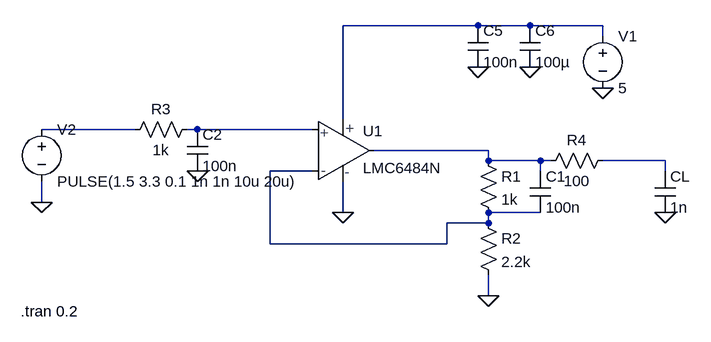
[diagram p0: schematic Levelshifter.asc]
Levelshifter.asc, the LTspice schematic file:
Version 4
SHEET 1 1276 680
WIRE 384 -32 176 -32
WIRE 464 -32 384 -32
WIRE 576 -32 464 -32
WIRE 576 -16 576 -32
WIRE 176 112 176 -32
WIRE -144 128 -288 128
WIRE -48 128 -64 128
WIRE 128 128 -48 128
WIRE 400 160 224 160
WIRE 400 176 400 160
WIRE 480 176 400 176
WIRE 496 176 480 176
WIRE 672 176 576 176
WIRE 128 192 64 192
WIRE 480 192 480 176
WIRE 672 192 672 176
WIRE -288 240 -288 208
WIRE 176 256 176 208
WIRE 480 256 400 256
WIRE 400 272 400 256
WIRE 400 272 336 272
WIRE 64 304 64 192
WIRE 336 304 336 272
WIRE 336 304 64 304
WIRE 400 384 400 352
FLAG 400 384 0
FLAG 176 256 0
FLAG 384 32 0
FLAG 464 32 0
FLAG -48 192 0
FLAG -288 240 0
FLAG 576 64 0
FLAG 672 256 0
SYMBOL res 384 160 R0
SYMATTR InstName R1
SYMATTR Value 1k
SYMBOL res 384 256 R0
SYMATTR InstName R2
SYMATTR Value 2.2k
SYMBOL res -48 112 R90
WINDOW 0 0 56 VBottom 2
WINDOW 3 32 56 VTop 2
SYMATTR InstName R3
SYMATTR Value 1k
SYMBOL res 592 160 R90
WINDOW 0 0 56 VBottom 2
WINDOW 3 32 56 VTop 2
SYMATTR InstName R4
SYMATTR Value 100
SYMBOL cap -64 128 R0
SYMATTR InstName C2
SYMATTR Value 100n
SYMBOL cap 368 -32 R0
SYMATTR InstName C5
SYMATTR Value 100n
SYMBOL cap 448 -32 R0
SYMATTR InstName C6
SYMATTR Value 100µ
SYMBOL cap 464 192 R0
SYMATTR InstName C1
SYMATTR Value 100n
SYMBOL voltage 576 -32 R0
WINDOW 123 0 0 Left 0
WINDOW 39 0 0 Left 0
SYMATTR InstName V1
SYMATTR Value 5
SYMBOL voltage -288 112 R0
WINDOW 123 0 0 Left 0
WINDOW 39 0 0 Left 0
SYMATTR InstName V2
SYMATTR Value PULSE(1.5 3.3 0.1 1n 1n 10u 20u)
SYMBOL cap 656 192 R0
SYMATTR InstName CL
SYMATTR Value 1n
SYMBOL LMC6484N 160 160 R0
SYMATTR InstName U1
TEXT -320 408 Left 2 !.tran 0.2

The netlist it stands for:
* Levelshifter.asc
R1 N004 N006 1k
R2 N006 0 2.2k
R3 N003 N002 1k
R4 N005 N004 100
C2 N003 0 100n
C5 N001 0 100n
C6 N001 0 100µ
C1 N004 N006 100n
V1 N001 0 5
V2 N002 0 PULSE(1.5 3.3 0.1 1n 1n 10u 20u)
CL N005 0 1n
XU1 N003 N006 N001 0 N004 LMC6484N/NS  ; pins +in -in V+ V- out
.tran 0.2
.lib LMC6484N.txt
.backanno
.end